# Altium schematic sheet BilgeFanDriver.SchDoc
size A; SheetNumber: 4; SheetTotal: 9
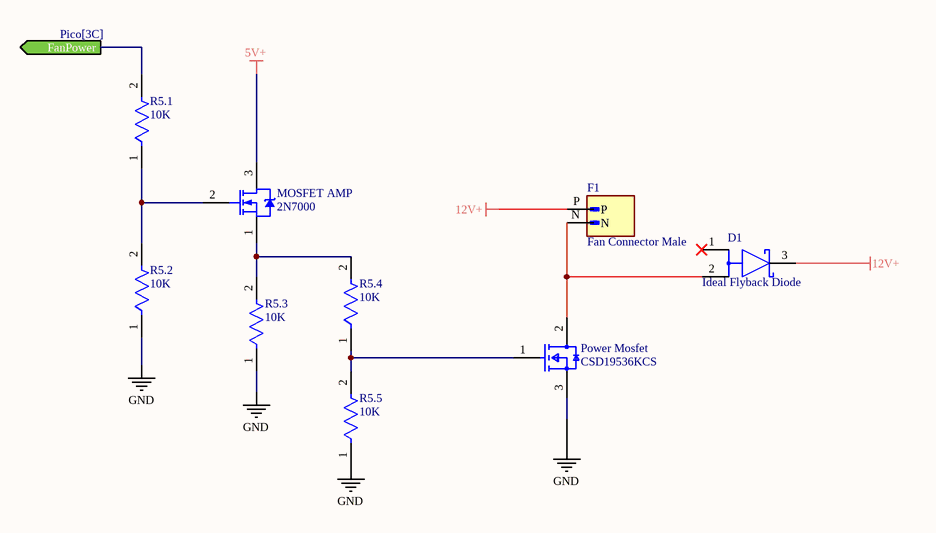
[diagram p0: BilgeFanDriver.SchDoc]

## Parts
D1  Ideal Flyback Diode  [FP-340BQ-MFG]
F1  Fan Connector Male  [AMASS_XT30UPB-M]  (no BOM)
MOSFET_AMP  2N7000  [ONSC-TO-92-3-29-11]
Power_Mosfet  CSD19536KCS  [FP-KCS0003B-MFG]
R5.1  10K  [FP-MFR-12-MFG]
R5.2  10K  [FP-MFR-12-MFG]
R5.3  10K  [FP-MFR-12-MFG]
R5.4  10K  [FP-MFR-12-MFG]
R5.5  10K  [FP-MFR-12-MFG]

## Ports
FanPower (out, see Pico[3C])

## Nets
5V+: MOSFET_AMP.3(D)
12V+: D1.3(C) F1.P
GND: Power_Mosfet.3(Source) R5.2.1 R5.3.1 R5.5.1
FanPower: R5.1.2 ; port FanPower
NetD1_2: D1.2(A) F1.N Power_Mosfet.2(Drain)
NetMOSFET_AMP_1: MOSFET_AMP.1(S) R5.3.2 R5.4.2
NetMOSFET_AMP_2: MOSFET_AMP.2(G) R5.1.1 R5.2.2
NetPower_Mosfet_1: Power_Mosfet.1(Gate) R5.4.1 R5.5.2

Not connected (* = marked no-connect by the designer): D1 1(A)*

## Library data of the parts
D1 = CMP-004-00031-1: Rectifier Diode, Schottky, 1 Phase, 1 Element, 5A, 40V V(RRM), Silicon, TO-277; Manufacturer Lifecycle Status: ACTIVE; Max Forward Surge Current (Ifsm): 150A; Peak Reverse Current: 250µA; Element Configuration: Single; Max Junction Temperature (Tj): 150°C; Number of Elements: 1; Forward Voltage: 520mV; Value: 730pF; Forward Current: 5A; Country of Origin: Mainland China; Export Control Classification Number (ECCN) Code: EAR99; Schedule B: 8541100080, 8541100080; Height: 1.2mm; Max Reverse Voltage (DC): 40V; Max Repetitive Reverse Voltage (Vrrm): 40V; Average Rectified Current: 5A; Harmonized Tariff Schedule (HTS) Code: 8541.10.00.80; Packaging: Cut Tape; Mounting Technology: Surface Mount; Min Operating Temperature: -55°C; Max Output current: 5A; Number of Terminals: 3; Weight: 113.6mg; Max Operating Temperature: 150°C; Introduction Date: 2015-10-16; China RoHS: Non-Compliant; Lifecycle Status: Production; Reverse Standoff Voltage: 40V; REACH SVHC: No; Reverse Voltage: 40V; RoHS: Compliant; Case/Package: TO-277-3
F1 = XT30UPB-M: Socket; DC supply; XT30; male; PIN: 2; on PCBs; THT; yellow; 15A; 500V; MF: amass; SnapEDA_Link: https://www.snapeda.com/parts/XT30UPB-M/AMASS/view-part/?ref=snap; Package: None; Value: *; MP: XT30UPB-M; Check_prices: https://www.snapeda.com/parts/XT30UPB-M/AMASS/view-part/?ref=eda
MOSFET_AMP = CMP-1058-00936-1: Small Signal MOSFET, 200 mA, 60 V, N-Channel, 3-Pin TO-92, Bulk Box; Manufacturer: On Semiconductor; Ciss Typ (pF): 60; VGS(th) Max (V): 3; Crss Typ (pF): 5; Channel Polarity: N Channel; VGS Max (V): 20; Configuration: Single; PD Max (W): 0.35; Coss Typ (pF): 25; ID Max (A): 0.2; PackageVersion: Rev. AM; ComponentLink3URL: http://www.onsemi.cn/pub_link/Collateral/2N6426-D.PDF; ComponentLink2URL: http://www.onsemi.com/pub_link/Collateral/2N7000-D.PDF; DatasheetVersion: Rev. 8; Mounting Technology: Through Hole; V(BR)DSS Min (V): 60; PartNumber: 2N7000; PackageDescription: 3-Pin Transistor Outline, Body 4.825 x 3.685 mm, Pitch 1.27 mm; ComponentLink2Description: Datasheet; ComponentLink1URL: http://www.onsemi.com/; PackageReference: TO-92-3-29-11_AM_SL; Packing: Bulk Box; ComponentLink1Description: Manufacturer URL; Package Type: TO-92; ComponentLink3Description: Package Specification
Power_Mosfet = CMP-04962-000045-1: MOSFET N-CH 100V TO-220; Continuous Drain Current (ID): 150A; Input Capacitance: 12nF; Gate to Source Voltage (Vgs): 20V; Element Configuration: Single; Rise Time: 8ns; Rds On Max: 2.7mR; Threshold Voltage: 2.5V; Turn-On Delay Time: 14ns; Turn-Off Delay Time: 38ns; Max Power Dissipation: 375W; Number of Channels: 1; Drain to Source Resistance: 2.5mR; Fall Time: 5ns; REACH SVHC: No SVHC; RoHS Compliant: Yes; Min Operating Temperature: -55°C; Max Operating Temperature: 175°C; Drain to Source Breakdown Voltage: 100V; Height: 16.51mm; Lead Free: Lead Free; Number of Pins: 3; Drain to Source Voltage (Vdss): 100V; Case/Package: TO-220; Packaging: Rail/Tube; Package Quantity: 50; Weight: 0.211644oz; Length: 10.67mm; Width: 4.7mm; Contact Plating: Tin; Mount: Through Hole
R5.1-R5.5 = CMP-03413-000012-1: RES MF 1/6W 1% AXIAL; Power Rating: 160mW; Voltage Rating (DC): 200V; Resistance: 10kR; Min Operating Temperature: -55°C; Max Operating Temperature: 155°C; Voltage Rating: 200V; Termination: Axial; Packaging: Ammo Pack; Tolerance: 1%